# EAGLE board Stearns2pi (EAGLE 6.6.0)
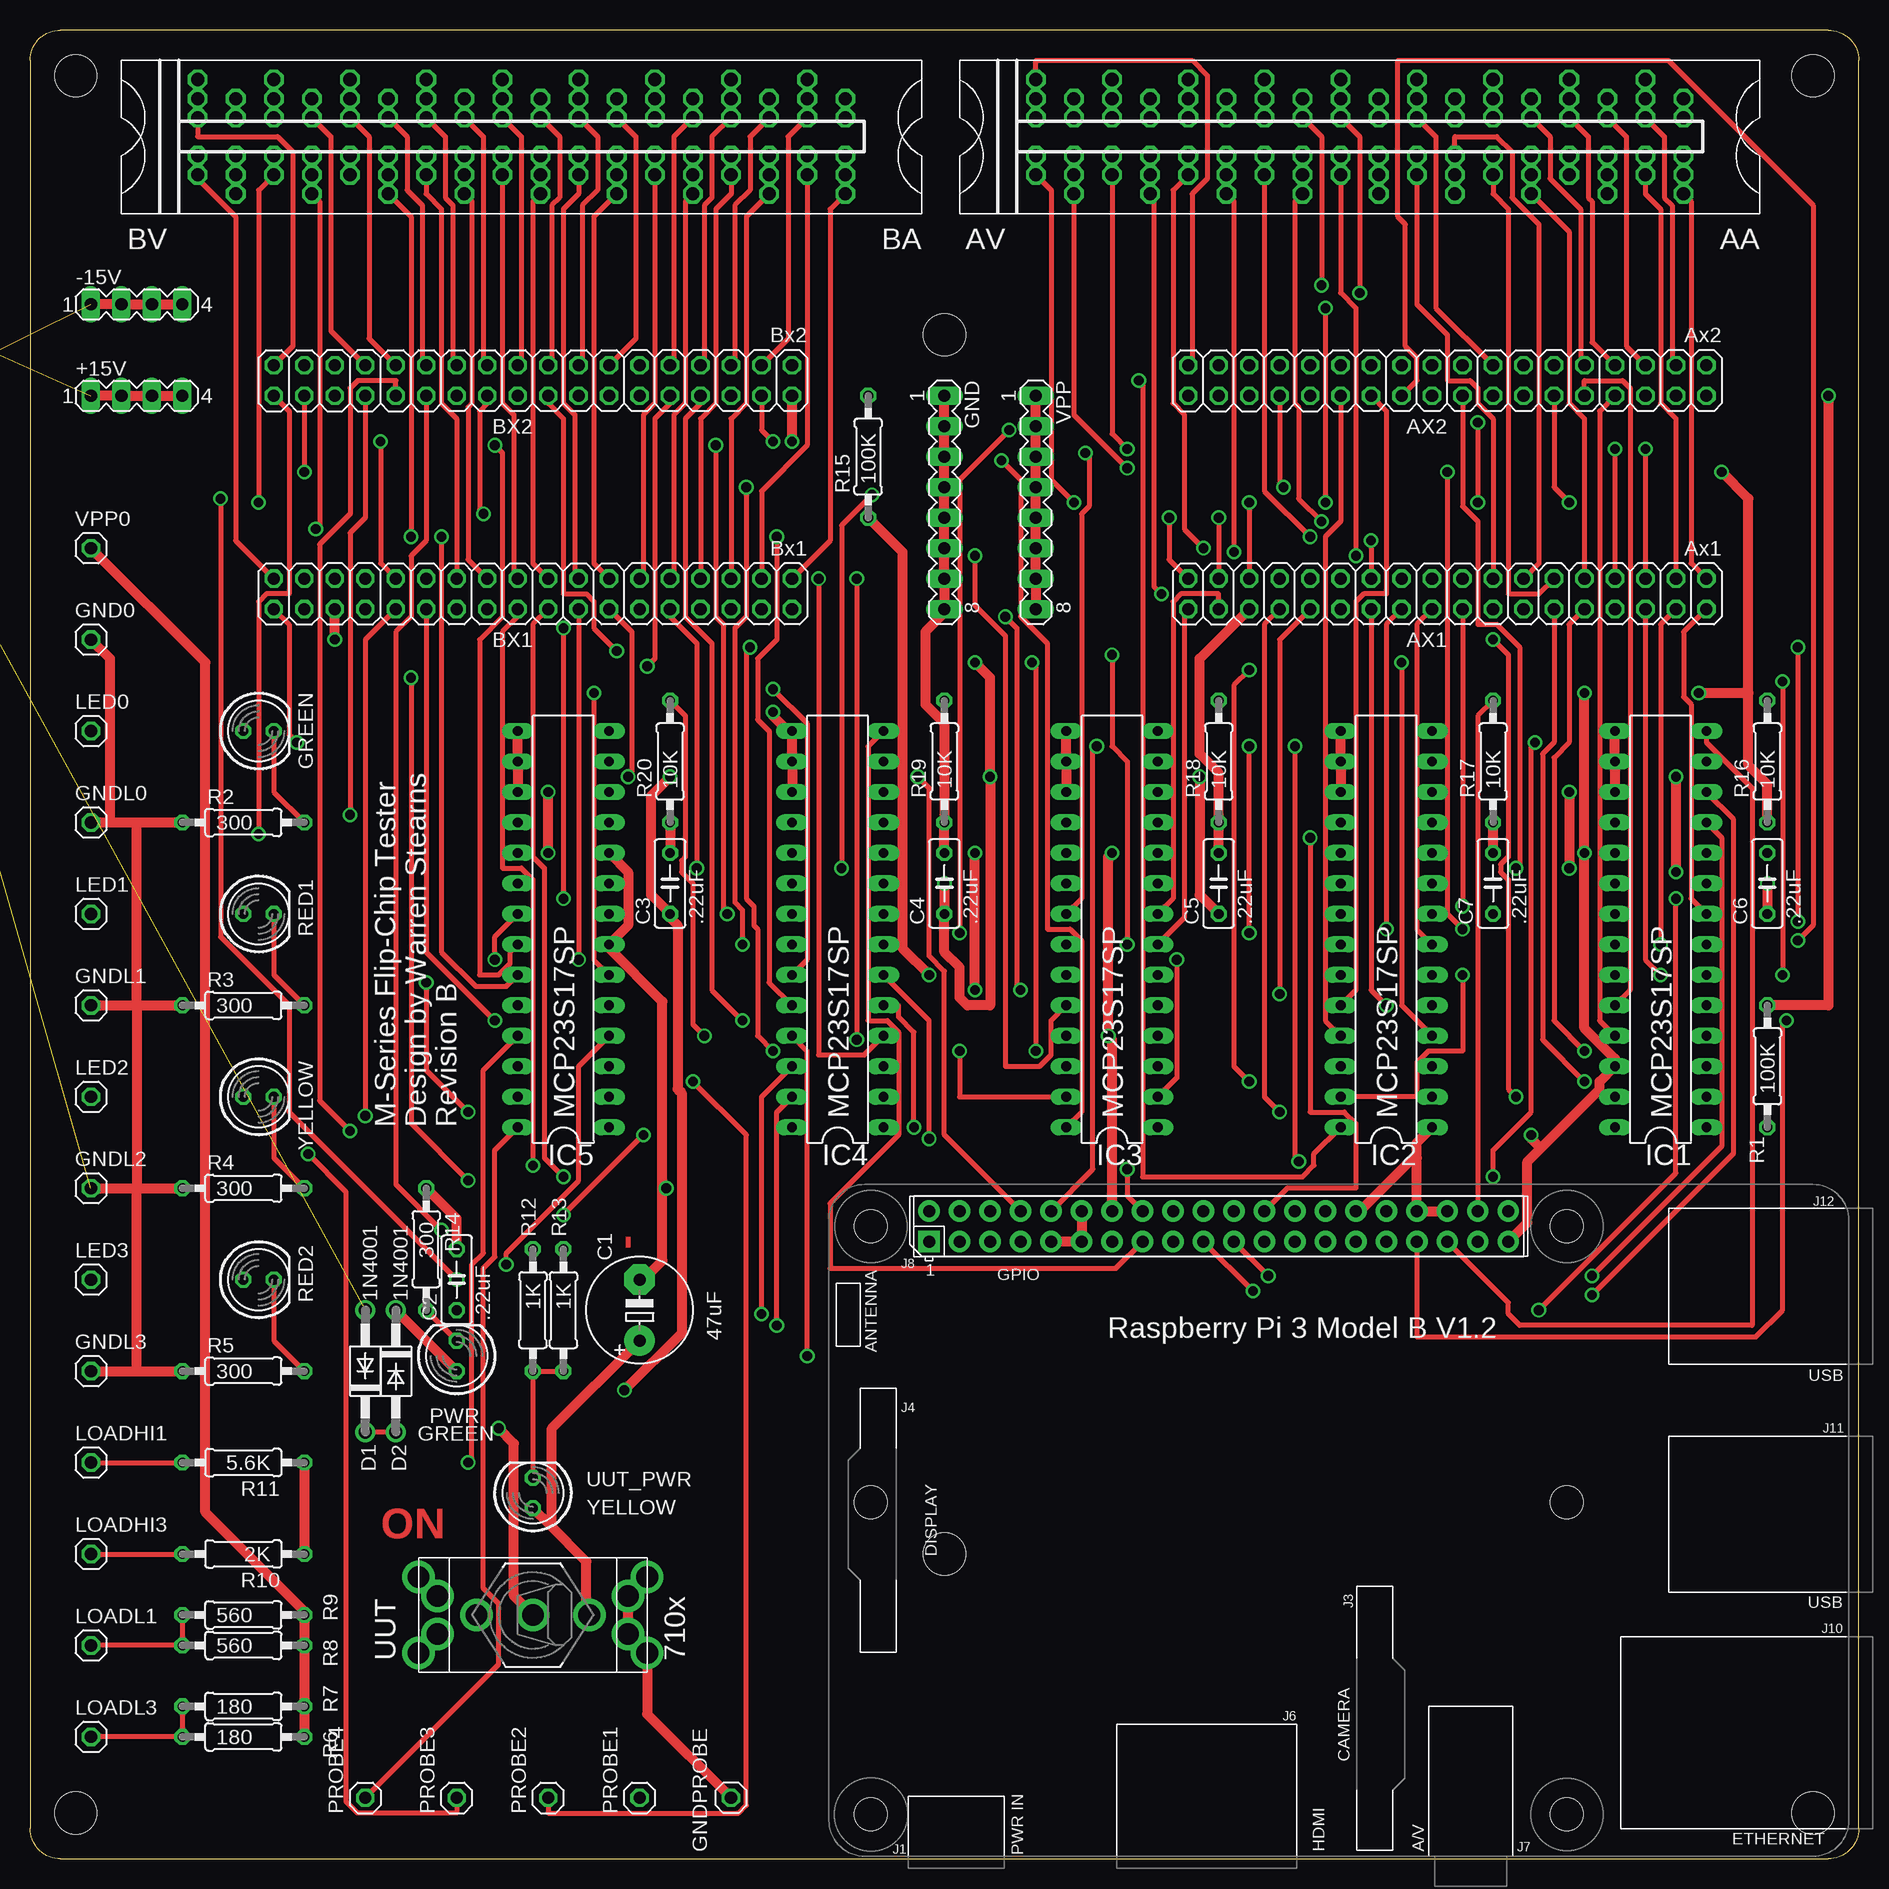
[diagram p1: board, top side]
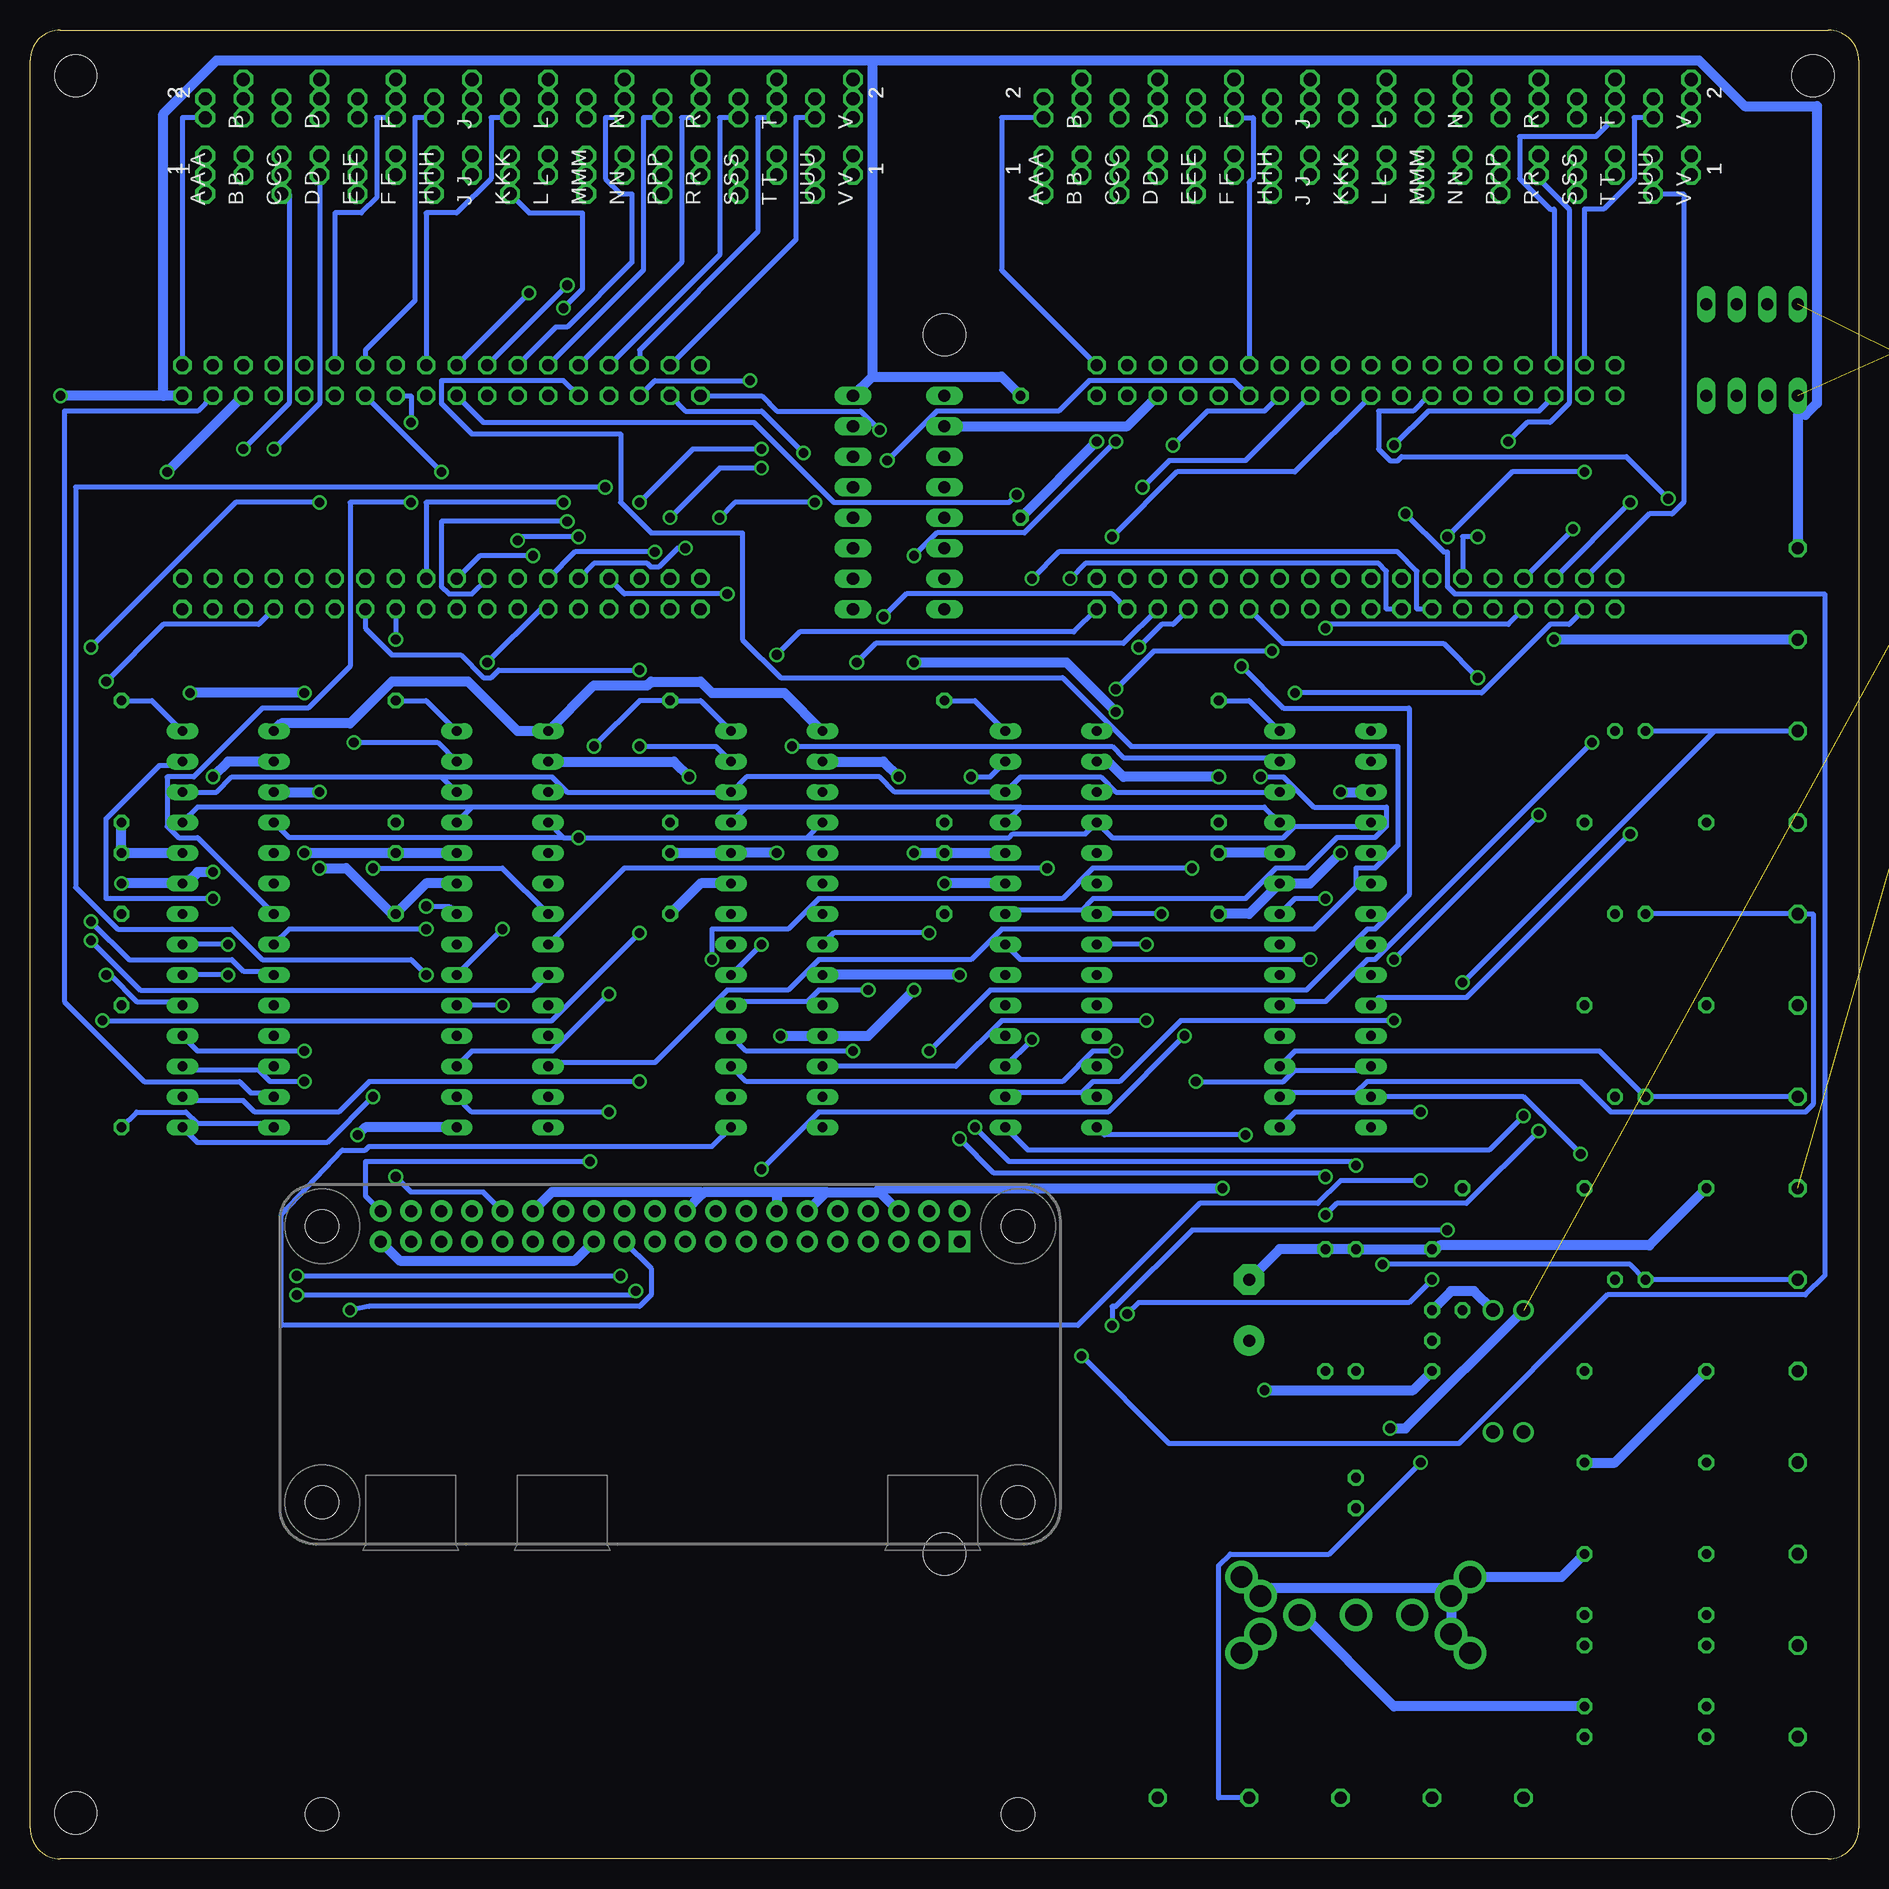
[diagram p2: board, bottom side, seen from below]

Size 152.4 x 152.4 mm. Coordinates in mm from the lower left corner, seen from the top.
Outline: 149.86,152.4 2.54,152.4 arc90 0,149.86 0,2.54 arc90 2.54,0 149.86,0 arc90 152.4,2.54 152.4,149.86 arc90 149.86,152.4
Copper layers (1+16): Top 0.035mm / dielectric 1.5mm / Bottom 0.035mm
Design rules "16mils *": minimum track width 16mil, minimum drill 32mil, track to track 15mil, track to pad 10mil, pad to pad 10mil, via to via 10mil, smd to smd 10mil, copper to edge 13mil, drill to drill 10mil, minimum pad ring 10mil, minimum via ring 8mil, stop-mask expansion 0mil, vias tented up to drill 0mil, thermal gap 10mil
Net classes: 1 Supply: width 0.813 mm
Holes 3.51 mm at 148.59,148.59 3.81,148.59 3.81,3.81 148.59,3.81 76.2,127 76.2,25.4

## Footprints (pad centres in the part's own frame; a part is rotated, then mirrored left to right if it is on the bottom)
MA04-1 = drill 1.016 long: 1 -3.81,0; 2 -1.27,0; 3 1.27,0; 4 3.81,0
2X18 = drill 1.016 octagon: 1 -21.59,-1.27; 2 -21.59,1.27; 3 -19.05,-1.27; 4 -19.05,1.27; 5 -16.51,-1.27; 6 -16.51,1.27; 7 -13.97,-1.27; 8 -13.97,1.27; 9 -11.43,-1.27; 10 -11.43,1.27; 11 -8.89,-1.27; 12 -8.89,1.27; 13 -6.35,-1.27; 14 -6.35,1.27; 15 -3.81,-1.27; 16 -3.81,1.27; 17 -1.27,-1.27; 18 -1.27,1.27; 19 1.27,-1.27; 20 1.27,1.27; 21 3.81,-1.27; 22 3.81,1.27; 23 6.35,-1.27; 24 6.35,1.27; 25 8.89,-1.27; 26 8.89,1.27; 27 11.43,-1.27; 28 11.43,1.27; 29 13.97,-1.27; 30 13.97,1.27; 31 16.51,-1.27; 32 16.51,1.27; 33 19.05,-1.27; 34 19.05,1.27; 35 21.59,-1.27; 36 21.59,1.27
E5-8,5 = drill 1.016 pad 2.54: + -2.54,0 | drill 1.016 pad 2.54 octagon: - 2.54,0
C050-025X075 = drill 0.813 octagon: 1 -2.54,0; 2 2.54,0
DO41-10 = drill 1.118: A 5.08,0; C -5.08,0
H807-2 = drill 1.092 octagon: AA1 4.763,60.325; AA2 -1.587,60.325; AB1 1.587,57.15; AB2 -4.763,57.15; AC1 4.763,53.975; AC2 -1.587,53.975; AD1 1.587,50.8; AD2 -4.763,50.8; AE1 4.763,47.625; AE2 -1.587,47.625; AF1 1.587,44.45; AF2 -4.763,44.45; AH1 4.763,41.275; AH2 -1.587,41.275; AJ1 1.587,38.1; AJ2 -4.763,38.1; AK1 4.763,34.925; AK2 -1.587,34.925; AL1 1.587,31.75; AL2 -4.763,31.75; AM1 4.763,28.575; AM2 -1.587,28.575; AN1 1.587,25.4; AN2 -4.763,25.4; AP1 4.763,22.225; AP2 -1.587,22.225; AR1 1.587,19.05; AR2 -4.763,19.05; AS1 4.763,15.875; AS2 -1.587,15.875; AT1 1.587,12.7; AT2 -4.763,12.7; AU1 4.763,9.525; AU2 -1.587,9.525; AV1 1.587,6.35; AV2 -4.763,6.35; BA1 4.763,-9.525; BA2 -1.587,-9.525; BB1 1.587,-12.7; BB2 -4.763,-12.7; BC1 4.763,-15.875; BC2 -1.587,-15.875; BD1 1.587,-19.05; BD2 -4.763,-19.05; BE1 4.763,-22.225; BE2 -1.587,-22.225; BF1 1.587,-25.4; BF2 -4.763,-25.4; BH1 4.763,-28.575; BH2 -1.587,-28.575; BJ1 1.587,-31.75; BJ2 -4.763,-31.75; BK1 4.763,-34.925; BK2 -1.587,-34.925; BL1 1.587,-38.1; BL2 -4.763,-38.1; BM1 4.763,-41.275; BM2 -1.587,-41.275; BN1 1.587,-44.45; BN2 -4.763,-44.45; BP1 4.763,-47.625; BP2 -1.587,-47.625; BR1 1.587,-50.8; BR2 -4.763,-50.8; BS1 4.763,-53.975; BS2 -1.587,-53.975; BT1 1.587,-57.15; BT2 -4.763,-57.15; BU1 4.763,-60.325; BU2 -1.587,-60.325; BV1 1.587,-63.5; BV2 -4.763,-63.5
ECS2418-2 = drill 1.092 octagon: AA1 1.587,60.325; AA2 -1.587,60.325; AB1 1.587,57.15; AB2 -1.587,57.15; AC1 1.587,53.975; AC2 -1.587,53.975; AD1 1.587,50.8; AD2 -1.587,50.8; AE1 1.587,47.625; AE2 -1.587,47.625; AF1 1.587,44.45; AF2 -1.587,44.45; AH1 1.587,41.275; AH2 -1.587,41.275; AJ1 1.587,38.1; AJ2 -1.587,38.1; AK1 1.587,34.925; AK2 -1.587,34.925; AL1 1.587,31.75; AL2 -1.587,31.75; AM1 1.587,28.575; AM2 -1.587,28.575; AN1 1.587,25.4; AN2 -1.587,25.4; AP1 1.587,22.225; AP2 -1.587,22.225; AR1 1.587,19.05; AR2 -1.587,19.05; AS1 1.587,15.875; AS2 -1.587,15.875; AT1 1.587,12.7; AT2 -1.587,12.7; AU1 1.587,9.525; AU2 -1.587,9.525; AV1 1.587,6.35; AV2 -1.587,6.35; BA1 1.587,-9.525; BA2 -1.587,-9.525; BB1 1.587,-12.7; BB2 -1.587,-12.7; BC1 1.587,-15.875; BC2 -1.587,-15.875; BD1 1.587,-19.05; BD2 -1.587,-19.05; BE1 1.587,-22.225; BE2 -1.587,-22.225; BF1 1.587,-25.4; BF2 -1.587,-25.4; BH1 1.587,-28.575; BH2 -1.587,-28.575; BJ1 1.587,-31.75; BJ2 -1.587,-31.75; BK1 1.587,-34.925; BK2 -1.587,-34.925; BL1 1.587,-38.1; BL2 -1.587,-38.1; BM1 1.587,-41.275; BM2 -1.587,-41.275; BN1 1.587,-44.45; BN2 -1.587,-44.45; BP1 1.587,-47.625; BP2 -1.587,-47.625; BR1 1.587,-50.8; BR2 -1.587,-50.8; BS1 1.587,-53.975; BS2 -1.587,-53.975; BT1 1.587,-57.15; BT2 -1.587,-57.15; BU1 1.587,-60.325; BU2 -1.587,-60.325; BV1 1.587,-63.5; BV2 -1.587,-63.5
EDAC346-36-2 = drill 1.092 octagon: AA1 3.175,60.325; AA2 -3.175,60.325; AB1 3.175,57.15; AB2 -3.175,57.15; AC1 3.175,53.975; AC2 -3.175,53.975; AD1 3.175,50.8; AD2 -3.175,50.8; AE1 3.175,47.625; AE2 -3.175,47.625; AF1 3.175,44.45; AF2 -3.175,44.45; AH1 3.175,41.275; AH2 -3.175,41.275; AJ1 3.175,38.1; AJ2 -3.175,38.1; AK1 3.175,34.925; AK2 -3.175,34.925; AL1 3.175,31.75; AL2 -3.175,31.75; AM1 3.175,28.575; AM2 -3.175,28.575; AN1 3.175,25.4; AN2 -3.175,25.4; AP1 3.175,22.225; AP2 -3.175,22.225; AR1 3.175,19.05; AR2 -3.175,19.05; AS1 3.175,15.875; AS2 -3.175,15.875; AT1 3.175,12.7; AT2 -3.175,12.7; AU1 3.175,9.525; AU2 -3.175,9.525; AV1 3.175,6.35; AV2 -3.175,6.35; BA1 3.175,-9.525; BA2 -3.175,-9.525; BB1 3.175,-12.7; BB2 -3.175,-12.7; BC1 3.175,-15.875; BC2 -3.175,-15.875; BD1 3.175,-19.05; BD2 -3.175,-19.05; BE1 3.175,-22.225; BE2 -3.175,-22.225; BF1 3.175,-25.4; BF2 -3.175,-25.4; BH1 3.175,-28.575; BH2 -3.175,-28.575; BJ1 3.175,-31.75; BJ2 -3.175,-31.75; BK1 3.175,-34.925; BK2 -3.175,-34.925; BL1 3.175,-38.1; BL2 -3.175,-38.1; BM1 3.175,-41.275; BM2 -3.175,-41.275; BN1 3.175,-44.45; BN2 -3.175,-44.45; BP1 3.175,-47.625; BP2 -3.175,-47.625; BR1 3.175,-50.8; BR2 -3.175,-50.8; BS1 3.175,-53.975; BS2 -3.175,-53.975; BT1 3.175,-57.15; BT2 -3.175,-57.15; BU1 3.175,-60.325; BU2 -3.175,-60.325; BV1 3.175,-63.5; BV2 -3.175,-63.5
MA08-1 = drill 1.016 long: 1 -8.89,0; 2 -6.35,0; 3 -3.81,0; 4 -1.27,0; 5 1.27,0; 6 3.81,0; 7 6.35,0; 8 8.89,0
1X01 = drill 1.016 octagon: 1 0,0
LED5MM = drill 0.813 octagon: A -1.27,0; K 1.27,0
DIL28-3 = drill 0.813 long: 1 -16.51,-3.81; 2 -13.97,-3.81; 3 -11.43,-3.81; 4 -8.89,-3.81; 5 -6.35,-3.81; 6 -3.81,-3.81; 7 -1.27,-3.81; 8 1.27,-3.81; 9 3.81,-3.81; 10 6.35,-3.81; 11 8.89,-3.81; 12 11.43,-3.81; 13 13.97,-3.81; 14 16.51,-3.81; 15 16.51,3.81; 16 13.97,3.81; 17 11.43,3.81; 18 8.89,3.81; 19 6.35,3.81; 20 3.81,3.81; 21 1.27,3.81; 22 -1.27,3.81; 23 -3.81,3.81; 24 -6.35,3.81; 25 -8.89,3.81; 26 -11.43,3.81; 27 -13.97,3.81; 28 -16.51,3.81
1X6MTA = drill 1.676 long: 1 9.906,0; 2 5.944,0; 3 1.981,0; 4 -1.981,0; 5 -5.944,0; 6 -9.906,0
0207/10 = drill 0.813 octagon: 1 -5.08,0; 2 5.08,0
RPI3 = drill 1 pad 1.778 square: 1 0,0 | drill 1 pad 1.778: 2 0,2.54; 3 2.54,0; 4 2.54,2.54; 5 5.08,0; 6 5.08,2.54; 7 7.62,0; 8 7.62,2.54; 9 10.16,0; 10 10.16,2.54; 11 12.7,0; 12 12.7,2.54; 13 15.24,0; 14 15.24,2.54; 15 17.78,0; 16 17.78,2.54; 17 20.32,0; 18 20.32,2.54; 19 22.86,0; 20 22.86,2.54; 21 25.4,0; 22 25.4,2.54; 23 27.94,0; 24 27.94,2.54; 25 30.48,0; 26 30.48,2.54; 27 33.02,0; 28 33.02,2.54; 29 35.56,0; 30 35.56,2.54; 31 38.1,0; 32 38.1,2.54; 33 40.64,0; 34 40.64,2.54; 35 43.18,0; 36 43.18,2.54; 37 45.72,0; 38 45.72,2.54; 39 48.26,0; 40 48.26,2.54 | hole 2.75: -4.857,-47.732; 53.143,-47.732; -4.857,1.268; 53.143,1.268
RPI0 = drill 1 pad 1.778 square: 1 0,0 | drill 1 pad 1.778: 2 0,2.54; 3 2.54,0; 4 2.54,2.54; 5 5.08,0; 6 5.08,2.54; 7 7.62,0; 8 7.62,2.54; 9 10.16,0; 10 10.16,2.54; 11 12.7,0; 12 12.7,2.54; 13 15.24,0; 14 15.24,2.54; 15 17.78,0; 16 17.78,2.54; 17 20.32,0; 18 20.32,2.54; 19 22.86,0; 20 22.86,2.54; 21 25.4,0; 22 25.4,2.54; 23 27.94,0; 24 27.94,2.54; 25 30.48,0; 26 30.48,2.54; 27 33.02,0; 28 33.02,2.54; 29 35.56,0; 30 35.56,2.54; 31 38.1,0; 32 38.1,2.54; 33 40.64,0; 34 40.64,2.54; 35 43.18,0; 36 43.18,2.54; 37 45.72,0; 38 45.72,2.54; 39 48.26,0; 40 48.26,2.54 | hole 2.75: -4.87,-21.73; -4.87,1.27; 53.13,-21.73; 53.13,1.27
7109MD9V3 = drill 1.803: 1 0,4.699; 2 0,0; 3 0,-4.699; NC@1 -3.175,9.525; NC@2 -1.587,7.938; NC@3 3.175,9.525; NC@4 1.587,7.938; NC@5 -3.175,-9.525; NC@6 -1.587,-7.938; NC@7 1.587,-7.938; NC@8 3.175,-9.525

## Placement (x,y rotation side)
+15V  [MA04-1]  8.89,121.92 0 top
-15V  [MA04-1]  8.89,129.54 0 top
AX1  Ax1  [2X18]  118.11,105.41 180 top
AX2  Ax2  [2X18]  118.11,123.19 180 top
BX1  Bx1  [2X18]  41.91,105.41 180 top
BX2  Bx2  [2X18]  41.91,123.19 180 top
C1  47uF  [E5-8,5]  50.8,45.72 90 top
C2  .22uF  [C050-025X075]  35.56,48.26 90 top
C3  .22uF  [C050-025X075]  53.34,81.28 90 top
C4  .22uF  [C050-025X075]  76.2,81.28 90 top
C5  .22uF  [C050-025X075]  99.06,81.28 90 top
C6  .22uF  [C050-025X075]  144.78,81.28 90 top
C7  .22uF  [C050-025X075]  121.92,81.28 90 top
D1  1N4001  [DO41-10]  27.94,40.64 90 top
D2  1N4001  [DO41-10]  30.48,40.64 270 top
DEC  W971  [H807-2]  77.47,143.51 270 top
ECS  W971ECS  [ECS2418-2]  77.47,143.51 270 top
EDAC  W971EDAC  [EDAC346-36-2]  77.47,143.51 270 top
GND  [MA08-1]  76.2,113.03 270 top
GND0  [1X01]  5.08,101.6 0 top
GNDL0  [1X01]  5.08,86.36 0 top
GNDL1  [1X01]  5.08,71.12 0 top
GNDL2  [1X01]  5.08,55.88 0 top
GNDL3  [1X01]  5.08,40.64 0 top
GNDPROBE  [1X01]  58.42,5.08 270 top
GREEN  [LED5MM]  19.05,93.98 0 top
IC1  MCP23S17SP  [DIL28-3]  135.89,77.47 90 top
IC2  MCP23S17SP  [DIL28-3]  113.03,77.47 90 top
IC3  MCP23S17SP  [DIL28-3]  90.17,77.47 90 top
IC4  MCP23S17SP  [DIL28-3]  67.31,77.47 90 top
IC5  MCP23S17SP  [DIL28-3]  44.45,77.47 90 top
LED0  [1X01]  5.08,93.98 0 top
LED1  [1X01]  5.08,78.74 0 top
LED2  [1X01]  5.08,63.5 0 top
LED3  [1X01]  5.08,48.26 0 top
LOADHI1  [1X01]  5.08,33.02 0 top
LOADHI3  [1X01]  5.08,25.4 0 top
LOADL1  [1X01]  5.08,17.78 0 top
LOADL3  [1X01]  5.08,10.16 0 top
POWER  [1X6MTA]  -11.43,119.38 270 top  (outside the outline)
PROBE1  [1X01]  50.8,5.08 90 top
PROBE2  [1X01]  43.18,5.08 90 top
PROBE3  [1X01]  35.56,5.08 90 top
PROBE4  [1X01]  27.94,5.08 90 top
PWR  GREEN  [LED5MM]  35.56,41.91 90 top
R1  100K  [0207/10]  144.78,66.04 90 top
R2  300  [0207/10]  17.78,86.36 0 top
R3  300  [0207/10]  17.78,71.12 0 top
R4  300  [0207/10]  17.78,55.88 0 top
R5  300  [0207/10]  17.78,40.64 0 top
R6  180  [0207/10]  17.78,10.16 0 top
R7  180  [0207/10]  17.78,12.7 0 top
R8  560  [0207/10]  17.78,17.78 0 top
R9  560  [0207/10]  17.78,20.32 0 top
R10  2K  [0207/10]  17.78,25.4 180 top
R11  5.6K  [0207/10]  17.78,33.02 180 top
R12  1K  [0207/10]  41.91,45.72 270 top
R13  1K  [0207/10]  44.45,45.72 270 top
R14  300  [0207/10]  33.02,50.8 270 top
R15  100K  [0207/10]  69.85,116.84 90 top
R16  10K  [0207/10]  144.78,91.44 90 top
R17  10K  [0207/10]  121.92,91.44 90 top
R18  10K  [0207/10]  99.06,91.44 90 top
R19  10K  [0207/10]  76.2,91.44 90 top
R20  10K  [0207/10]  53.34,91.44 90 top
RASPI1  RPI3  [RPI3]  74.93,51.44 0 top
RASPI2  RPI0  [RPI0]  74.93,51.44 0 top
RED1  [LED5MM]  19.05,78.74 0 top
RED2  [LED5MM]  19.05,48.26 0 top
UUT  710x  [7109MD9V3]  41.91,20.32 90 top
UUT_PWR  YELLOW  [LED5MM]  41.91,30.48 90 top
VPP  [MA08-1]  83.82,113.03 270 top
VPP0  [1X01]  5.08,109.22 0 top
YELLOW  [LED5MM]  19.05,63.5 0 top

## Tracks (layer width: path | path; a pad name or v marks a point on that pad's centre or on a via)
+15V  (1 unrouted)
  Top 0.813: +15V.1 +15V.2 +15V.3 +15V.4
-15V  (1 unrouted)
  Top 0.813: -15V.1 -15V.2 -15V.3 -15V.4
AA1J
  Top 0.406: IC1.8 138.43,80.01 138.43,96.2 137.79,96.84 137.79,102.23 AX1.2
AA2J
  Bottom 0.406: IC1.28 132.4,61.28 138.43,61.28 139.38,62.23 143.51,62.23 R1.1
AB1J  (via drill 0.81)
  Top 0.406: v135.89,76.2 135.89,102.87 AX1.4
  Bottom 0.406: v135.89,76.2 IC1.7
AB2J
  Bottom 0.406: IC1.27 132.4,63.82 133.99,63.82 134.94,64.77 142.88,64.77 149.54,71.44 149.54,120.65 138.43,120.65 AX2.4
AC1J  (via drill 0.81)
  Top 0.406: v135.89,73.66 134.62,74.93 AX1.6
  Bottom 0.406: v135.89,73.66 IC1.6
AD1J  (via drill 0.81)
  Top 0.406: v146.05,98.11 v146.05,73.66
  Bottom 0.406: IC1.5 140.02,71.44 143.51,71.44 145.73,73.66 v146.05,73.66 | v146.05,98.11 141.29,102.87 133.35,102.87 AX1.8
AD2J
  Top 0.406: IC1.25 130.81,69.85 130.81,120.65 AX2.8
AE1J  (via drill 0.81)
  Top 0.406: v129.54,67.31 127,69.85 127,91.76 128.27,93.03 128.27,102.87 AX1.10
  Bottom 0.406: IC1.4 138.43,67.31 v129.54,67.31
AE2J
  Top 0.406: IC1.24 133.35,72.39 133.35,122.56 132.72,123.19 129.54,123.19 AX2.10
AF1J  (via drill 0.81)
  Top 0.406: v129.54,64.77 126.05,68.26 126.05,92.08 127,93.03 AX1.12
  Bottom 0.406: IC1.3 139.38,65.72 133.35,65.72 132.4,64.77 v129.54,64.77
AF2J  (via drill 0.81)
  Top 0.406: v147.32,100.97 v147.32,78.11 | v128.27,113.03 127,114.3 AX2.12
  Bottom 0.406: IC1.23 132.4,73.98 134.62,73.98 135.57,74.93 144.15,74.93 v147.32,78.11 | v147.32,100.97 135.25,113.03 v128.27,113.03
AH1J  (via drill 0.81)
  Top 0.406: v101.6,64.77 100.33,66.04 100.33,97.79 v101.6,99.06
  Bottom 0.406: IC1.2 139.38,63.18 134.62,63.18 133.67,62.23 126.68,62.23 124.14,64.77 v101.6,64.77 | v101.6,99.06 113.35,99.06 113.98,98.42 114.62,98.42 116.52,100.33 122.24,100.33 124.46,102.55 AX1.14
AH2J  (via drill 0.81)
  Top 0.406: v119.38,77.47 118.11,78.74 v118.11,115.57
  Bottom 0.406: IC1.22 130.81,77.47 v119.38,77.47 | AX2.14 v118.11,115.57
AJ1J  (via drill 0.81)
  Top 0.406: v123.83,63.5 123.19,64.14 123.19,81.6 122.56,82.23 122.56,82.87 123.19,83.5 123.19,100.33 v121.92,101.6
  Bottom 0.406: IC1.1 138.43,59.69 127.64,59.69 v123.83,63.5 | AX1.16 v121.92,101.6
AJ2J  (via drill 0.81)
  Top 0.406: v120.65,119.7 v120.65,113.03
  Bottom 0.406: IC1.21 138.43,85.09 140.02,85.09 140.97,86.04 140.97,90.17 138.75,90.17 133.03,95.89 129.22,95.89 125.73,99.38 125.73,113.03 v120.65,113.03 | v120.65,119.7 120.65,121.92 AX2.16
AK1J  (via drill 0.81)
  Top 0.406: AX1.18 v119.38,79.38
  Bottom 0.406: IC2.8 117.47,79.38 v119.38,79.38
AK2J  (via drill 0.81)
  Top 0.406: v123.83,82.55 124.14,82.87 124.14,100.97 122.24,102.87 120.65,102.87 120.65,111.44 119.38,112.71 AX2.18
  Bottom 0.406: IC2.21 113.03,82.55 v123.83,82.55
AL1J
  Top 0.406: IC2.7 115.57,77.47 115.57,102.87 AX1.20
AL2J  (via drill 0.81)
  Top 0.406: v67.63,82.55 67.63,111.12 v70.17,113.67
  Bottom 0.406: IC2.22 102.87,82.55 v67.63,82.55 | v70.17,113.67 70.8,113.03 85.41,113.03 92.08,119.7 114.62,119.7 AX2.20
AM1J  (via drill 0.81)
  Top 0.406: v113.03,77.47 113.03,102.87 AX1.22
  Bottom 0.406: v113.03,77.47 IC2.6
AM2J  (via drill 0.81)
  Top 0.406: v147.32,76.52 148.59,77.79 148.59,137.79 136.53,149.86 113.98,149.86 113.98,136.84 114.62,136.21 114.62,126.05 115.57,125.09 115.57,123.19 AX2.22
  Bottom 0.406: IC2.23 110.49,72.39 143.19,72.39 v147.32,76.52
AN1J  (via drill 0.81)
  Top 0.406: v113.03,71.12 111.76,72.39 AX1.24
  Bottom 0.406: v113.03,71.12 IC2.5
AN2J
  Top 0.406: IC2.24 110.49,72.39 110.49,104.78 111.12,105.41 113.03,105.41 113.03,120.65 AX2.24
AP1J  (via drill 0.81)
  Top 0.406: IC2.4 114.3,71.12 v114.3,99.69
  Bottom 0.406: v114.3,99.69 109.86,104.14 AX1.26
AP2J
  Top 0.406: IC2.25 107.95,69.85 107.95,110.17 109.22,111.44 AX2.26
AR1J  (via drill 0.81)
  Top 0.406: v104.14,72.07 104.14,101.6 AX1.28
  Bottom 0.406: IC2.3 115.57,67.31 108.9,67.31 v104.14,72.07
AR2J
  Bottom 0.406: IC2.26 108.9,66.36 100.33,66.36 94.3,72.39 89.22,72.39 86.68,74.93 73.98,74.93 71.44,77.47 45.4,77.47 41.91,80.96 41.91,82.55 40.32,82.55 38.42,84.45 38.42,92.71 60.64,92.71 66.36,98.42 89.85,98.42 93.03,101.6 93.03,110.49 100.65,110.49 103.19,113.03 103.19,118.75 115.57,118.75 118.11,121.28 118.11,123.19 107.95,123.19 AX2.28
AS1J  (via drill 0.81)
  Top 0.406: v104.14,62.23 102.87,63.5 102.87,102.87 AX1.30
  Bottom 0.406: IC2.2 115.57,62.23 v104.14,62.23
AS2J  (via drill 0.81)
  Top 0.406: IC2.27 115.57,63.5 115.57,66.36 116.52,67.31 119.38,67.31 v119.38,73.66 | v104.46,114.3 104.14,114.62 AX2.30
  Bottom 0.406: v119.38,73.66 120.65,74.93 133.03,74.93 135.57,77.47 145.1,77.47 148.59,80.96 148.59,114.3 v104.46,114.3
AT2J  (via drill 0.81)
  Top 0.406: IC2.28 107,58.74 107,57.78 106.05,56.83 92.71,56.83 92.71,122.87 v92.39,123.19
  Bottom 0.406: v92.39,123.19 100.33,123.19 AX2.32
AU1J
  Top 0.406: IC3.8 95.25,80.01 95.25,104.78 95.89,105.41 99.06,105.41 AX1.34
AU2J  (via drill 0.81)
  Top 0.406: IC3.21 87.63,80.01 87.63,112.08 88.27,112.71 88.27,116.84 v87.95,117.16
  Bottom 0.406: v87.95,117.16 91.44,120.65 97.79,120.65 AX2.34
AV1J
  Top 0.406: IC3.7 96.2,78.42 96.2,103.82 AX1.36
AV2J  (via drill 0.81)
  Top 0.406: v77.47,77.15 77.47,114.94 v81.6,119.06
  Bottom 0.406: IC3.22 85.41,77.15 v77.47,77.15 | v81.6,119.06 83.19,120.65 90.17,120.65 91.44,121.92 AX2.36
BA1J  (via drill 0.81)
  Top 0.406: v91.44,76.2 91.44,91.44 90.17,92.71 v90.17,100.33
  Bottom 0.406: v91.44,76.2 IC3.6 | v90.17,100.33 88.27,102.23 65.41,102.23 BX1.2
BA2J  (via drill 0.81)
  Top 0.813: v74.93,73.66 72.71,75.88 72.71,108.9 R15.1 | v63.5,118.11 BX2.2
  Bottom 0.813: v74.93,73.66 IC3.23 | R15.1 v63.5,118.11
BB1J  (via drill 0.81)
  Top 0.406: v82.55,72.39 82.23,72.71 82.23,102.55 v81.28,103.5
  Bottom 0.406: IC3.5 93.66,71.44 87.63,71.44 86.68,72.39 v82.55,72.39 | v81.28,103.5 79.38,105.41 62.23,105.41 BX1.4
BB2J  (via drill 0.81)
  Top 0.406: IC3.24 85.09,69.85 85.09,66.99 84.14,66.04 81.28,66.04 81.28,101.92 78.74,104.46 v78.74,108.58 | v61.91,118.11 60.96,119.06 BX2.4
  Bottom 0.406: v78.74,108.58 76.83,110.49 69.53,110.49 v61.91,118.11
BC1J  (via drill 0.81)
  Top 0.406: v83.82,67.31 83.82,99.38 v83.5,99.69
  Bottom 0.406: IC3.4 92.71,67.31 v83.82,67.31 | v83.5,99.69 81.92,101.28 61.28,101.28 BX1.6
BD1J  (via drill 0.81)
  Top 0.406: v61.91,67.31 60.64,68.58 60.64,77.47 60.33,77.79 60.33,79.38 59.69,80.01 59.69,100.65 v60.01,100.97
  Bottom 0.406: IC3.3 92.71,64.77 66.36,64.77 63.82,67.31 v61.91,67.31 | v60.01,100.97 58.1,102.87 57.15,102.87 BX1.8
BD2J  (via drill 0.81)
  Top 0.406: v59.37,69.85 56.83,72.39 56.83,101.28 54.61,103.5 54.61,120.02 55.88,121.28 BX2.8
  Bottom 0.406: IC3.26 75.25,66.04 71.44,69.85 v59.37,69.85
BE1J  (via drill 0.81)
  Top 0.406: IC3.2 95.57,65.09 v95.57,74.93 | v55.56,82.55 55.56,101.28 53.34,103.5 BX1.10
  Bottom 0.406: v95.57,74.93 95.57,77.47 89.22,77.47 86.68,80.01 66.36,80.01 63.82,82.55 v55.56,82.55
BE2J  (via drill 0.81)
  Top 0.406: IC3.27 77.47,63.5 v77.47,67.31 | v51.44,99.38 52.07,100.01 52.07,120.02 53.34,121.28 BX2.10
  Bottom 0.406: v77.47,67.31 72.39,72.39 46.04,72.39 40.96,77.47 40.32,77.47 37.47,80.33 37.47,95.89 47.94,95.89 v51.44,99.38
BF1J  (via drill 0.81)
  Top 0.406: v36.51,56.52 31.75,61.28 v31.75,98.42
  Bottom 0.406: IC3.1 95.57,59.37 124.14,59.37 124.46,59.05 126.36,59.05 131.44,53.66 131.44,44.45 65.09,44.45 54.93,54.61 45.09,54.61 43.18,56.52 v36.51,56.52 | v31.75,98.42 34.61,101.28 47.94,101.28 BX1.12
BF2J  (via drill 0.81)
  Top 0.406: IC3.28 87.63,62.23 87.63,76.52 86.68,77.47 84.77,77.47 84.77,101.28 82.55,103.5 82.55,114.94 v80.96,116.52
  Bottom 0.406: v80.96,116.52 76.83,120.65 66.67,120.65 64.14,123.19 52.07,123.19 BX2.12
BH1J  (via drill 0.81)
  Top 0.406: v49.85,90.17 50.16,90.49 50.16,102.23 BX1.14
  Bottom 0.406: IC4.8 70.8,79.06 64.77,79.06 63.82,80.01 51.12,80.01 48.58,82.55 46.04,82.55 43.5,85.09 40.32,85.09 39.37,86.04 39.37,87.63 45.4,87.63 47.94,90.17 v49.85,90.17
BH2J  (via drill 0.81)
  Top 0.406: v58.1,78.74 57.78,79.06 57.78,102.87 57.15,103.5 v57.15,117.79
  Bottom 0.406: v58.1,78.74 IC4.21 | v57.15,117.79 54.29,120.65 49.53,120.65 BX2.14
BJ1J  (via drill 0.81)
  Top 0.406: BX1.16 v45.72,74.93
  Bottom 0.406: IC4.7 69.85,74.93 v45.72,74.93
BJ2J  (via drill 0.81)
  Top 0.406: v59.37,76.2 59.37,79.06 58.74,79.69 58.74,102.55 59.69,103.5 v59.69,114.3
  Bottom 0.406: v59.37,76.2 IC4.22 | v59.69,114.3 57.47,116.52 51.12,116.52 BX2.16
BK1J  (via drill 0.81)
  Top 0.406: IC4.6 74.93,69.85 v74.93,60.01 | v44.45,56.83 42.86,58.42 42.86,82.55 41.91,83.5 41.91,102.87 BX1.18
  Bottom 0.406: v74.93,60.01 72.07,57.15 44.77,57.15 v44.45,56.83
BK2J  (via drill 0.81)
  Top 0.406: IC4.23 64.77,74.93 64.77,94.61 v61.91,97.47 | v48.9,100.65 46.99,102.55 46.99,104.78 46.35,105.41 44.45,105.41 44.45,120.02 43.18,121.28 BX2.18
  Bottom 0.406: v61.91,97.47 58.74,100.65 v48.9,100.65
BL1J  (via drill 0.81)
  Top 0.406: IC4.5 72.39,71.12 72.39,70.17 73.66,68.9 v73.66,60.96 | v41.91,57.78 41.91,81.6 40.96,82.55 39.37,82.55 39.37,102.23 40.64,103.5 BX1.20
  Bottom 0.406: v73.66,60.96 70.8,58.1 42.23,58.1 v41.91,57.78
BL2J  (via drill 0.81)
  Top 0.406: IC4.24 61.59,73.03 61.59,93.98 60.64,94.93 60.64,100.01 62.23,101.6 v62.23,110.17
  Bottom 0.406: v62.23,110.17 56.83,115.57 46.99,115.57 BX2.20
BM1J  (via drill 0.81)
  Top 0.406: IC4.4 69.53,66.99 65.72,66.99 v65.72,106.68
  Bottom 0.406: v65.72,106.68 64.45,107.95 40.01,107.95 39.37,107.31 39.37,104.14 BX1.22
BM2J  (via drill 0.81)
  Top 0.406: IC4.25 64.77,67.31 v64.77,41.91 | v37.78,112.08 37.47,112.39 37.47,120.65 38.1,121.28 BX2.22
  Bottom 0.406: v64.77,41.91 57.47,34.61 33.34,34.61 20.95,46.99 4.45,46.99 2.86,48.58 2.86,105.41 33.66,105.41 34.29,106.05 34.29,108.9 34.61,108.9 v37.78,112.08
BN1J  (via drill 0.81)
  Top 0.406: v68.9,106.68 v68.9,68.26
  Bottom 0.406: v68.9,68.26 IC4.3 | v68.9,106.68 66.67,108.9 38.42,108.9 36.83,107.31 36.83,104.14 BX1.24
BN2J  (via drill 0.81)
  Top 0.406: IC4.26 60.96,63.5 v60.96,45.4 | v35.56,48.26 21.59,62.23 21.59,71.12 15.88,76.83 v15.88,113.35
  Bottom 0.406: v60.96,45.4 60.01,46.35 37.47,46.35 v35.56,48.26 | v15.88,113.35 19.37,116.84 38.1,116.84 38.42,116.52 39.05,116.52 40.01,117.47 40.01,120.65 37.15,120.65 35.88,121.92 BX2.24
BP1J  (via drill 0.81)
  Top 0.406: v38.73,69.85 33.02,75.56 BX1.26
  Bottom 0.406: IC4.2 70.8,63.82 64.77,63.82 63.82,64.77 61.59,64.77 56.52,69.85 v38.73,69.85
BP2J  (via drill 0.81)
  Top 0.406: IC4.27 62.23,62.23 v62.23,44.45 | v34.29,52.39 30.48,56.2 30.48,102.23 31.75,103.5 31.75,108.58 33.02,109.86 BX2.26
  Bottom 0.406: v62.23,44.45 62.23,46.04 61.91,46.04 55.56,52.39 v34.29,52.39
BR1J  (via drill 0.81)
  Top 0.406: v27.94,61.91 27.94,101.6 BX1.28
  Bottom 0.406: IC4.1 69.22,59.05 30.8,59.05 v27.94,61.91
BR2J  (via drill 0.81)
  Top 0.406: v44.45,53.66 v51.12,60.33 | v26.67,60.64 24.13,63.18 24.13,109.54 26.67,112.08 26.67,122.56 27.3,123.19 30.48,123.19 BX2.28
  Bottom 0.406: IC4.28 62.87,60.33 v51.12,60.33 | v44.45,53.66 43.5,54.61 32.7,54.61 v26.67,60.64
BS1J  (via drill 0.81)
  Top 0.406: v44.45,102.55 v44.45,80.01
  Bottom 0.406: IC5.8 46.99,80.01 v44.45,80.01 | v44.45,102.55 44.13,102.87 29.21,102.87 BX1.30
BS2J  (via drill 0.81)
  Top 0.406: IC5.21 38.73,76.83 v38.73,74.93 | v26.67,87 26.67,110.49 27.94,111.76 BX2.30
  Bottom 0.406: v26.67,87 v38.73,74.93
BT2J  (via drill 0.81)
  Top 0.406: IC5.22 40.01,75.56 40.01,74.61 39.05,73.66 37.47,73.66 37.47,101.6 39.37,103.5 39.37,117.16 v38.73,117.79
  Bottom 0.406: v38.73,117.79 35.88,120.65 26.67,120.65 BX2.32
BU1J  (via drill 0.81)
  Top 0.406: IC5.6 46.99,74.93 v46.99,97.16
  Bottom 0.406: v46.99,97.16 31.43,97.16 25.72,102.87 24.13,102.87 BX1.34
BU2J  (via drill 0.81)
  Top 0.406: IC5.23 39.69,72.71 37.15,72.71 34.29,75.56 v34.29,110.17 | BX2.34 v22.86,115.57
  Bottom 0.406: v34.29,110.17 28.89,115.57 v22.86,115.57
BV1J  (via drill 0.81)
  Top 0.406: v22.23,93.03 21.59,93.66 21.59,102.87 BX1.36
  Bottom 0.406: IC5.5 47.94,71.44 44.45,71.44 40.96,74.93 40.32,74.93 v22.23,93.03
BV2J  (via drill 0.81)
  Top 0.406: v19.05,85.41 19.05,104.78 19.68,105.41 21.59,105.41 21.59,120.65 BX2.36
  Bottom 0.406: IC5.24 40.01,71.75 32.7,71.75 v19.05,85.41
CLK  (via drill 0.81)
  Top 0.406: v101.92,47.31 RASPI2.19 | v130.18,46.99 141.92,58.74 141.92,86.68 IC1.12
  Bottom 0.406: IC5.12 61.91,88.9 63.18,90.17 69.85,90.17 IC4.12 80.33,88.9 81.6,90.17 92.71,90.17 IC3.12 107.63,88.9 108.9,90.17 118.11,90.17 | 118.11,90.17 IC2.12 | 118.11,90.17 135.57,90.17 136.84,88.9 IC1.12 | v101.92,47.31 102.23,46.99 v130.18,46.99
CS-N  (via drill 0.81)
  Top 0.406: v103.19,48.58 RASPI2.21 | v130.18,48.58 140.97,59.37 140.97,85.09 IC1.11
  Bottom 0.406: IC5.11 49.53,87.63 69.85,87.63 | IC4.11 69.85,87.63 | 92.71,87.63 IC3.11 | 69.85,87.63 92.71,87.63 | 115.57,87.63 IC2.11 | 92.71,87.63 115.57,87.63 | IC1.11 138.43,87.63 115.57,87.63 | v130.18,48.58 v103.19,48.58
GND  (via drill 0.81)  (1 unrouted)
  Top 0.813: R20.1 C3.2 | IC5.10 49.85,82.23 49.85,77.79 IC5.7 48.26,75.88 52.7,71.44 52.7,55.88 | R14.1 35.56,53.34 C2.2 | 52.7,55.88 52.7,49.85 51.12,48.26 C1.- | GNDL0.1 6.67,86.36 | 6.67,86.36 8.89,86.36 | 8.89,86.36 R2.1 | GND0.1 6.67,100.01 6.67,86.36 | v25.4,101.6 BX1.32 | UUT.NC@8 UUT.NC@7 UUT.NC@6 51.12,17.46 51.12,17.14 UUT.NC@5 51.44,12.06 GNDPROBE.1 | GNDL2.1 8.89,55.88 | 8.89,55.88 R4.1 | GNDL1.1 8.89,71.12 | 8.89,71.12 R3.1 | 8.89,71.12 8.89,55.88 | UUT.NC@2 UUT.NC@1 | GNDL3.1 8.89,40.64 | 8.89,40.64 R5.1 | R11.1 R10.1 | 8.89,40.64 8.89,55.88 | 8.89,71.12 8.89,86.36 | v140.97,115.57 143.19,113.35 143.19,97.16 | 143.19,97.16 143.19,91.12 144.78,89.53 R16.1 | C7.2 R17.1 | 125.89,59.21 124.78,58.1 124.78,53.02 RASPI2.39 | 125.89,59.21 130.81,64.14 130.81,64.77 IC1.26 132.08,66.67 129.54,69.22 v129.54,83.82 v129.54,97.16 | v139.06,97.16 143.19,97.16 | C4.2 R19.1 76.2,94.61 74.61,96.2 74.61,102.23 76.2,103.82 GND.8 GND.7 GND.6 GND.5 GND.4 GND.3 GND.2 GND.1 | C5.2 R18.1 99.06,90.49 97.47,92.08 97.47,100.01 AX1.32 | RASPI2.14 90.17,68.26 v89.85,68.58 89.85,83.5 v90.17,83.82 | IC2.1 115.57,59.69 115.57,58.42 | 115.57,58.42 RASPI2.34 RASPI2.36 | RASPI2.30 110.81,53.98 115.25,58.42 115.57,58.42 | RASPI2.9 RASPI2.11 RASPI2.12 | v78.74,72.39 v78.74,83.82 | 125.89,59.21 125.09,60.01 v125.09,60.33 | v53.02,55.88 52.7,55.88
  Bottom 0.813: IC5.10 C3.2 | C1.- 48.26,50.8 R13.1 R12.1 C2.2 35.24,50.8 34.92,51.12 17.46,51.12 R4.1 | GND0.1 v25.4,101.6 | R10.1 24.77,23.5 UUT.NC@3 32.38,23.18 32.7,23.18 UUT.NC@4 | R5.1 20.32,33.02 R11.1 | UUT.NC@4 UUT.NC@2 | UUT.NC@7 49.21,22.54 33.66,22.54 UUT.NC@4 | IC1.10 C6.2 R16.1 | v140.97,115.57 AX2.6 | IC2.10 C7.2 v129.54,83.82 | RASPI2.25 107,49.85 121.6,49.85 RASPI2.39 | v129.54,97.16 v139.06,97.16 | IC4.10 C4.2 v78.74,83.82 | BX2.6 60.96,119.38 GND.2 | C5.2 IC3.10 v90.17,83.82 | v89.85,68.58 IC3.25 82.55,68.58 v78.74,72.39 | 81.6,55.56 RASPI2.6 | 86.04,55.56 81.6,55.56 | RASPI2.12 86.04,55.56 | 96.36,55.4 96.2,55.56 90.17,55.56 | 96.36,55.4 RASPI2.20 | 86.04,55.56 90.17,55.56 | RASPI2.30 108.9,55.56 96.52,55.56 96.36,55.4 | 90.17,55.56 RASPI2.14 | v125.09,60.33 124.46,60.96 IC2.1 | v53.02,55.88 81.6,55.88 81.6,55.56
  pour Bottom (isolate 0.406): 314.96,152.4 162.56,152.4 162.56,0 314.96,0
  pour Top (isolate 0.406): 314.96,152.4 162.56,152.4 162.56,0 314.96,0
LED0  (via drill 0.81)
  Top 0.406: v36.51,62.23 33.02,65.72 v33.02,73.03
  Bottom 0.406: LED0.1 12.06,93.98 | 12.06,93.98 GREEN.A | IC5.1 46.99,62.23 v36.51,62.23 | 12.06,93.98 v33.02,73.03
LED1
  Bottom 0.406: RED1.A LED1.1 3.81,78.74 3.81,62.87 4.45,62.23 20.64,62.23 23.18,64.77 40.96,64.77 41.91,63.82 47.94,63.82 IC5.2
LED2
  Bottom 0.406: LED2.1 YELLOW.A 21.59,67.31 46.99,67.31 IC5.3
LED3  (via drill 0.81)
  Top 0.406: IC5.4 45.72,66.04 45.72,56.52 39.69,50.48 v39.69,49.53
  Bottom 0.406: LED3.1 RED2.A 19.05,49.53 v39.69,49.53
N$1
  Top 0.406: ECS.AA1 EDAC.AA1 DEC.AA1 138.43,138.11 138.43,107.95 AX1.1
N$2  (via drill 0.81)
  Top 0.406: AX1.35 94.93,108.27 v94.93,111.76 | v87,113.03 85.09,114.94 85.09,139.06 EDAC.AV1 ECS.AV1
  Bottom 0.406: v94.93,111.76 93.66,113.03 v87,113.03
N$3  (via drill 0.81)
  Top 0.406: ECS.AU1 EDAC.AU1 DEC.AU1 87,120.33 v91.44,115.89 | v99.06,111.76 AX1.33
  Bottom 0.406: v99.06,111.76 94.93,115.89 v91.44,115.89
N$4  (via drill 0.81)
  Top 0.406: v101.6,113.03 AX1.31 | v91.44,117.47 90.17,118.75 EDAC.AT1 ECS.AT1
  Bottom 0.406: v101.6,113.03 97.16,117.47 v91.44,117.47
N$5  (via drill 0.81)
  Top 0.406: ECS.AS1 EDAC.AS1 DEC.AS1 93.66,138.43 93.66,106.05 v94.3,105.41
  Bottom 0.406: AX1.29 102.87,105.41 v94.3,105.41
N$6  (via drill 0.81)
  Top 0.406: v97.79,109.22 96.2,110.81 96.2,120.33 95.25,121.28 95.25,139.06 EDAC.AR1 ECS.AR1
  Bottom 0.406: AX1.27 105.41,107.95 100.97,107.95 100.65,107.63 100.01,107.63 98.42,109.22 v97.79,109.22
N$7  (via drill 0.81)
  Top 0.406: ECS.AP1 EDAC.AP1 DEC.AP1 100.33,138.11 v100.33,108.9
  Bottom 0.406: AX1.25 107,108.9 v100.33,108.9
N$8  (via drill 0.81)
  Top 0.406: v111.76,109.86 AX1.23 | v106.68,110.17 102.87,113.98 EDAC.AN1 ECS.AN1
  Bottom 0.406: v111.76,109.86 111.44,110.17 v106.68,110.17
N$9  (via drill 0.81)
  Top 0.406: ECS.AM1 EDAC.AM1 DEC.AM1 105.41,138.11 105.41,121.28 105.73,120.97 105.73,113.35 v107.63,111.44
  Bottom 0.406: AX1.21 115.57,105.41 117.47,105.41 118.11,106.05 118.11,111.44 v107.63,111.44
N$10  (via drill 0.81)
  Top 0.406: v110.49,108.58 110.49,129.22 109.22,130.49 EDAC.AL1 ECS.AL1
  Bottom 0.406: AX1.19 114.94,108.58 v110.49,108.58
N$11  (via drill 0.81)
  Top 0.406: ECS.AK1 EDAC.AK1 DEC.AK1 | v107.95,129.22 v107.95,113.03
  Bottom 0.406: AX1.17 119.38,113.03 v107.95,113.03 | v107.95,129.22 106.36,130.81 106.36,137.16 110.81,137.16 DEC.AK1
N$12
  Top 0.406: AX1.15 121.92,120.02 120.65,121.28 120.65,122.56 120.02,123.19 118.11,123.19 118.11,127 115.57,129.54 EDAC.AJ1 ECS.AJ1
N$13
  Top 0.406: DEC.AH1 EDAC.AH1 ECS.AH1 118.75,143.51 122.24,143.51 123.51,142.24 123.51,138.43 125.73,136.21 125.73,107.95 AX1.13
N$14
  Top 0.406: AX1.11 125.73,105.41 123.19,105.41 123.19,137.48 121.92,138.75 EDAC.AF1 ECS.AF1
N$15
  Top 0.406: ECS.AE1 EDAC.AE1 DEC.AE1 128.27,135.57 128.27,121.28 129.54,120.02 AX1.9
N$16  (via drill 0.81)
  Top 0.406: v132.08,117.47 AX1.7 | EDAC.AD1 ECS.AD1
  Bottom 0.406: v132.08,117.47 128.27,121.28 EDAC.AD1
N$17  (via drill 0.81)
  Top 0.406: ECS.AC1 EDAC.AC1 DEC.AC1 | v134.62,117.47 AX1.5
  Bottom 0.406: v134.62,117.47 130.81,121.28 130.81,138.75 DEC.AC1
N$18
  Top 0.406: AX1.3 137.16,120.02 135.89,121.28 135.89,137.48 134.62,138.75 EDAC.AB1 ECS.AB1
N$19
  Top 0.406: ECS.AA2 EDAC.AA2
  Bottom 0.406: AX2.1 139.7,145.1 ECS.AA2
N$20
  Top 0.406: DEC.AB2 EDAC.AB2 ECS.AB2 136.21,143.51 136.21,138.43 136.84,137.79 136.84,124.78 AX2.3
N$21
  Top 0.406: AX2.5 133.03,126.05 133.03,143.51 ECS.AC2 EDAC.AC2
N$22
  Top 0.406: DEC.AD2 EDAC.AD2 ECS.AD2 129.86,143.51 129.86,138.43 130.18,138.11 130.18,126.36 AX2.7
N$23
  Top 0.406: AX2.9 129.22,124.78 129.22,137.48 126.68,140.02 126.68,143.51 ECS.AE2 EDAC.AE2
N$24
  Top 0.406: DEC.AF2 EDAC.AF2 ECS.AF2
  Bottom 0.406: AX2.11 127,137.16 124.78,137.16 123.51,138.43 123.51,145.1 ECS.AF2
N$25
  Top 0.406: ECS.AH2 EDAC.AH2
  Bottom 0.406: AX2.13 124.46,125.73 120.33,129.86 120.33,145.1 ECS.AH2
N$26
  Top 0.406: DEC.AJ2 EDAC.AJ2 ECS.AJ2 117.16,143.51 117.16,129.22 AX2.15
N$27
  Top 0.406: ECS.AK2 EDAC.AK2
  Bottom 0.406: AX2.17 119.38,137.16 116.84,137.16 113.98,140.02 113.98,145.1 ECS.AK2
N$28  (via drill 0.81)
  Top 0.406: DEC.AL2 EDAC.AL2 ECS.AL2 110.81,143.51 v110.81,130.49
  Bottom 0.406: v110.81,130.49 AX2.19
N$29  (via drill 0.81)
  Top 0.406: v107.63,131.13 107.63,143.51 ECS.AM2 EDAC.AM2
  Bottom 0.406: v107.63,131.13 AX2.21
N$30
  Top 0.406: DEC.AN2 EDAC.AN2 ECS.AN2
  Bottom 0.406: AX2.23 108.58,127.64 107.63,127.64 102.23,133.03 102.23,138.75 103.19,138.75 104.46,140.02 104.46,145.1 ECS.AN2
N$31
  Top 0.406: ECS.AP2 EDAC.AP2
  Bottom 0.406: AX2.25 101.28,132.4 101.28,145.1 ECS.AP2
N$32
  Top 0.406: DEC.AR2 EDAC.AR2 ECS.AR2
  Bottom 0.406: AX2.27 98.11,133.03 98.11,145.1 ECS.AR2
N$33
  Top 0.406: ECS.AS2 EDAC.AS2
  Bottom 0.406: AX2.29 94.93,133.67 94.93,145.1 ECS.AS2
N$34
  Top 0.406: DEC.AT2 EDAC.AT2 ECS.AT2
  Bottom 0.406: AX2.31 101.6,125.73 91.76,135.57 91.76,145.1 ECS.AT2
N$35
  Top 0.406: ECS.AU2 EDAC.AU2
  Bottom 0.406: AX2.33 88.58,134.94 88.58,145.1 ECS.AU2
N$36
  Top 0.406: ECS.AV2 EDAC.AV2 DEC.AV2 83.82,149.86 96.84,149.86 98.11,148.59 98.11,140.02 96.84,138.75 96.84,124.78 AX2.35
N$37
  Top 0.406: ECS.BA2 EDAC.BA2
  Bottom 0.406: BX2.1 71.44,132.4 71.44,145.1 ECS.BA2
N$38
  Top 0.406: DEC.BB2 EDAC.BB2 ECS.BB2 63.18,143.51 63.18,126.68 BX2.3
N$39
  Top 0.406: BX2.5 58.74,124.78 58.74,137.79 60.01,139.06 60.01,143.51 ECS.BC2 EDAC.BC2
N$40
  Top 0.406: DEC.BD2 EDAC.BD2 ECS.BD2 56.83,143.51 56.83,138.43 56.2,137.79 56.2,124.78 BX2.7
N$41
  Top 0.406: BX2.9 53.66,124.78 53.66,143.51 ECS.BE2 EDAC.BE2
N$42
  Top 0.406: DEC.BF2 EDAC.BF2 ECS.BF2
  Bottom 0.406: BX2.11 50.8,139.7 50.48,140.02 50.48,145.1 ECS.BF2
N$43
  Top 0.406: BX2.13 50.48,126.68 50.48,143.51 ECS.BH2 EDAC.BH2
N$44
  Top 0.406: DEC.BJ2 EDAC.BJ2 ECS.BJ2 47.31,143.51 47.31,139.06 46.04,137.79 46.04,124.78 BX2.15
N$45
  Top 0.406: BX2.17 43.5,124.78 43.5,137.79 44.13,138.43 44.13,143.51 ECS.BK2 EDAC.BK2
N$46
  Top 0.406: DEC.BL2 EDAC.BL2 ECS.BL2 40.96,143.51 40.96,124.78 BX2.19
N$47
  Top 0.406: BX2.21 37.78,124.78 37.78,143.51 ECS.BM2 EDAC.BM2
N$48
  Top 0.406: DEC.BN2 EDAC.BN2 ECS.BN2 34.61,143.51 34.61,138.43 35.24,137.79 35.24,124.78 BX2.23
N$49
  Top 0.406: BX2.25 32.7,124.78 32.7,137.79 31.43,139.06 31.43,143.51 ECS.BP2 EDAC.BP2
N$50
  Top 0.406: DEC.BR2 EDAC.BR2 ECS.BR2 28.26,143.51 28.26,126.68 BX2.27
N$51
  Top 0.406: BX2.29 25.08,127.32 25.08,143.51 ECS.BS2 EDAC.BS2
N$52
  Top 0.406: DEC.BT2 EDAC.BT2 ECS.BT2
  Bottom 0.406: BX2.31 25.4,137.48 25.72,137.48 28.26,140.02 28.26,143.51 21.91,143.51 ECS.BT2
N$53
  Top 0.406: ECS.BU2 EDAC.BU2
  Bottom 0.406: BX2.33 22.86,137.48 21.27,137.48 18.73,140.02 18.73,145.1 ECS.BU2
N$54
  Top 0.406: DEC.BV2 EDAC.BV2 ECS.BV2 13.97,143.51 20.64,143.51 21.91,142.24 21.91,126.05 BX2.35
N$55
  Top 0.406: ECS.BA1 EDAC.BA1 DEC.BA1 66.67,137.48 66.67,109.86 BX1.1
N$56
  Top 0.406: BX1.3 60.96,113.98 64.77,117.79 EDAC.BB1 ECS.BB1
N$57
  Top 0.406: ECS.BC1 EDAC.BC1 DEC.BC1 59.69,136.84 59.69,121.28 58.42,120.02 BX1.5
N$58
  Top 0.406: BX1.7 55.88,120.02 57.15,121.28 57.15,137.48 58.42,138.75 EDAC.BD1 ECS.BD1
N$59
  Top 0.406: ECS.BE1 EDAC.BE1 DEC.BE1 54.61,138.11 54.61,121.28 53.66,120.33 53.66,107 BX1.9
N$60
  Top 0.406: BX1.11 51.12,107 51.12,120.33 52.07,121.28 EDAC.BF1 ECS.BF1
N$61
  Top 0.406: ECS.BH1 EDAC.BH1 DEC.BH1 46.99,136.84 46.99,107.95 BX1.13
N$62
  Top 0.406: BX1.15 45.4,107 45.4,120.33 44.45,121.28 44.45,137.48 45.72,138.75 EDAC.BJ1 ECS.BJ1
N$63
  Top 0.406: ECS.BK1 EDAC.BK1 DEC.BK1 41.91,138.11 41.91,107.95 BX1.17
N$64
  Top 0.406: BX1.19 40.32,107 40.32,120.33 39.37,121.28 EDAC.BL1 ECS.BL1
N$65
  Top 0.406: ECS.BM1 EDAC.BM1 DEC.BM1 36.83,138.11 36.83,121.28 36.51,120.97 36.51,108.27 BX1.21
N$66
  Top 0.406: BX1.23 35.56,120.02 34.29,121.28 34.29,137.48 33.02,138.75 EDAC.BN1 ECS.BN1
N$67  (via drill 0.81)
  Top 0.406: ECS.BP1 EDAC.BP1 DEC.BP1 31.75,136.84 v31.75,110.17
  Bottom 0.406: BX1.25 33.02,110.17 v31.75,110.17
N$68  (via drill 0.81)
  Top 0.406: BX1.27 29.21,107.95 v29.21,118.11 | EDAC.BR1 ECS.BR1
  Bottom 0.406: v29.21,118.11 27.62,119.7 25.72,119.7 24.13,121.28 24.13,137.48 26.67,140.02 EDAC.BR1
N$69  (via drill 0.81)
  Top 0.406: ECS.BS1 EDAC.BS1 DEC.BS1 24.13,138.11 24.13,111.12 v23.81,110.81
  Bottom 0.406: v23.81,110.81 BX1.29
N$70  (via drill 0.81)
  Top 0.406: v19.05,113.03 19.05,139.06 EDAC.BT1 ECS.BT1
  Bottom 0.406: v19.05,113.03 BX1.31
N$71
  Top 0.406: ECS.BU1 EDAC.BU1 DEC.BU1
  Bottom 0.406: BX1.33 17.46,112.08 15.56,112.08 14.61,113.03 14.61,138.75 DEC.BU1
N$72
  Top 0.406: BX1.35 17.14,109.86 17.14,136.84 13.97,140.02 EDAC.BV1 ECS.BV1
N$73
  Top 0.406: R2.2 20.32,88.9 GREEN.K
N$74
  Top 0.406: R3.2 20.32,73.66 RED1.K
N$75
  Top 0.406: R4.2 20.32,58.42 YELLOW.K
N$76
  Top 0.406: R5.2 20.32,43.18 RED2.K
N$77
  Top 0.406: R7.1 R6.1 LOADL3.1
N$78
  Top 0.406: R9.1 R8.1 LOADL1.1
N$79
  Top 0.406: LOADHI1.1 R11.2
N$80
  Top 0.406: LOADHI3.1 R10.2
N$81
  Top 0.406: D2.A D1.C
N$82
  Top 0.406: UUT_PWR.K R12.2 R13.2
N$83
  Top 0.406: PWR.K R14.2
PROBE1  (via drill 0.81)
  Top 0.406: IC5.25 37.78,65.72 37.78,50.48 36.83,49.53 36.83,33.34 v36.51,33.02
  Bottom 0.406: v36.51,33.02 44.13,25.4 52.39,25.4 53.34,24.45 53.34,5.08 PROBE1.1
PROBE2  (via drill 0.81)
  Top 0.406: v55.24,64.77 59.69,60.33 59.69,4.45 59.05,3.81 43.18,3.81 PROBE2.1
  Bottom 0.406: IC5.26 40.96,65.72 46.99,65.72 47.94,64.77 v55.24,64.77
PROBE3  (via drill 0.81)
  Top 0.406: v23.18,58.74 26.35,55.56 26.35,4.76 27.3,3.81 35.56,3.81 PROBE3.1
  Bottom 0.406: IC5.27 27.94,63.5 v23.18,58.74
PROBE4
  Top 0.406: IC5.28 38.73,59.05 38.73,50.16 37.78,49.21 37.78,22.54 39.05,21.27 39.05,16.19 PROBE4.1
RESET-N  (via drill 0.81)
  Top 0.406: RASPI2.24 104.78,55.88 110.49,55.88 110.49,61.28 109.54,62.23 106.68,62.23 v106.68,85.09
  Bottom 0.406: IC5.18 40.96,86.04 46.99,86.04 47.94,85.09 62.23,85.09 IC4.18 64.45,85.41 70.48,85.41 70.8,85.09 87.63,85.09 | 87.63,85.09 IC3.18 | 107.95,85.09 v106.68,85.09 87.63,85.09 | IC2.18 107.95,85.09 | IC1.18 130.81,85.09 107.95,85.09
SI-A  (via drill 0.81)
  Top 0.406: v137.16,80.01 137.16,57.15 v125.73,45.72
  Bottom 0.406: IC1.13 140.02,91.12 141.6,91.12 146.05,86.68 146.05,80.01 v137.16,80.01 | v125.73,45.72 124.14,46.04 101.6,46.04 100.65,46.99 100.65,49.21 RASPI2.23
SI-B  (via drill 0.81)
  Top 0.406: v125.41,93.03 125.09,92.71 125.09,62.23 121.92,59.05 v121.92,56.83
  Bottom 0.406: IC2.13 118.43,93.03 v125.41,93.03 | v121.92,56.83 120.65,55.56 114.62,55.56 RASPI2.32
SI-C  (via drill 0.81)
  Top 0.406: v101.6,77.15 v101.6,92.71 | v146.37,69.85 146.05,69.53 146.05,45.72 143.83,43.5 115.57,43.5 RASPI2.33
  Bottom 0.406: IC3.13 95.25,92.71 v101.6,92.71 | v101.6,77.15 108.9,69.85 v146.37,69.85
SI-D  (via drill 0.81)
  Top 0.406: v73.98,90.17 74.93,89.22 74.93,75.25 76.2,73.98 76.2,60.33 RASPI2.8
  Bottom 0.406: IC4.13 72.39,90.17 v73.98,90.17
SI-E  (via drill 0.81)
  Top 0.406: v88.9,92.71 88.58,92.39 88.58,57.47 RASPI2.10
  Bottom 0.406: IC5.13 48.58,91.76 61.28,91.76 62.23,92.71 v88.9,92.71
SO-A
  Top 0.406: RASPI2.35 123.19,46.35 123.19,45.4 124.14,44.45 143.51,44.45 143.51,89.22 139.7,93.03 IC1.14
  Bottom 0.406: IC1.14 142.24,96.52 R16.2
SO-B
  Top 0.406: RASPI2.38 120.65,95.25 R17.2
  Bottom 0.406: IC2.14 119.38,96.52 R17.2
SO-C  (via drill 0.81)
  Top 0.406: v105.73,58.1 105.41,58.42 v105.41,92.71
  Bottom 0.406: IC3.14 96.52,96.52 R18.2 101.6,96.52 v105.41,92.71 | RASPI2.40 124.46,55.24 124.46,58.1 v105.73,58.1
SO-D
  Top 0.406: RASPI2.15 90.49,49.21 66.67,49.21 66.67,54.61 72.39,60.33 72.39,68.9 71.44,69.85 69.85,69.85 69.85,92.71 IC4.14
  Bottom 0.406: IC4.14 73.66,96.52 R19.2
SO-E  (via drill 0.81)
  Top 0.406: RASPI2.16 91.44,55.24 v91.44,57.47 | v56.2,68.58 55.24,69.53 55.24,81.28 54.29,82.23 54.29,83.19 54.61,83.5 54.61,95.25 R20.2
  Bottom 0.406: IC5.14 50.8,96.52 R20.2 | v91.44,57.47 86.68,62.23 62.55,62.23 v56.2,68.58
VCC  (via drill 0.81)  (1 unrouted)
  Top 0.813: v39.05,35.88 40.32,34.61 40.32,21.91 UUT.2
  Bottom 0.813: D1.A 37.78,35.88 v39.05,35.88
VDD  (via drill 0.81)
  Top 0.813: D2.C PWR.A | IC4.17 IC4.16 IC4.15 63.18,93.98 61.91,95.25 v61.91,95.57 | IC5.17 IC5.16 IC5.15 | v43.18,83.82 v43.18,88.9 | v53.34,90.17 51.75,88.58 51.75,80.33 C3.1 53.34,78.42 53.98,77.79 53.98,64.14 54.29,63.82 54.29,43.81 v49.53,39.05 | v144.78,81.28 C6.1 | v76.2,81.28 C4.1 76.2,75.56 77.47,74.3 77.47,71.75 78.11,71.12 80.01,71.12 v80.01,90.17 80.01,98.42 v78.74,99.69 | IC1.17 IC1.16 IC1.15 | IC3.17 IC3.16 IC3.15 | IC2.17 IC2.16 IC2.15 | C5.1 97.47,80.33 v97.47,90.17 | v128.27,88.9 v128.27,82.55 | v137.16,90.17 v137.16,82.23
  Bottom 0.813: C2.1 33.97,47.31 32.07,47.31 D2.C | C3.1 50.8,78.74 IC5.9 45.72,81.28 v43.18,83.82 | v43.18,88.9 IC5.17 | IC4.16 62.55,91.44 61.28,90.17 v53.34,90.17 | PWR.A 37.15,39.05 v49.53,39.05 | v144.78,81.28 IC1.9 139.38,81.28 138.43,82.23 v137.16,82.23 | IC2.9 119.38,81.28 C7.1 122.24,78.74 126.05,82.55 v128.27,82.55 | C5.1 96.52,81.28 IC3.9 | IC4.9 v76.2,81.28 | IC3.15 89.53,97.16 95.57,97.16 96.52,98.11 100.65,98.11 100.97,97.79 105.41,97.79 IC2.15 111.76,93.98 115.89,98.11 122.24,98.11 125.73,94.61 131.44,94.61 IC1.15 | v80.01,90.17 81.28,91.44 IC3.16 | v97.47,90.17 98.74,91.44 IC2.16 | IC1.17 v128.27,88.9 | v137.16,90.17 135.89,91.44 IC1.16 | v61.91,95.57 66.04,99.69 v78.74,99.69
VPP  (via drill 0.81)
  Top 0.813: 43.34,27.78 46.35,24.77 46.35,20.32 UUT.3 | 43.34,27.78 UUT_PWR.A | C1.+ 43.5,35.88 43.5,27.94 43.34,27.78 | R6.2 R7.2 R8.2 R9.2 22.86,20.64 14.61,28.89 14.61,99.69 VPP0.1 | VPP.8 VPP.7 VPP.6 VPP.5 VPP.4 VPP.3 VPP.2 VPP.1 | R1.2 149.86,71.12 v149.86,121.92
  Bottom 0.813: R7.2 38.73,12.7 46.35,20.32 UUT.3 | R15.2 71.44,123.51 82.23,123.51 | VPP.1 82.23,123.51 | AX2.2 141.29,121.92 | 141.29,121.92 v149.86,121.92 | 82.23,149.86 82.23,123.51 | 82.23,149.86 136.84,149.86 141.29,145.41 141.29,121.92 | VPP0.1 5.08,120.33 4.45,120.33 3.49,121.28 3.49,146.05 9.53,146.05 13.34,149.86 82.23,149.86

## Text on the board
Top: - | ON
tPlace: BV | BA | AV | AA | M-Series Flip-Chip Tester | Design by Warren Stearns | Revision B